# Altium schematic sheet Charging.SchDoc
size A; SheetNumber: 6; SheetTotal: 8
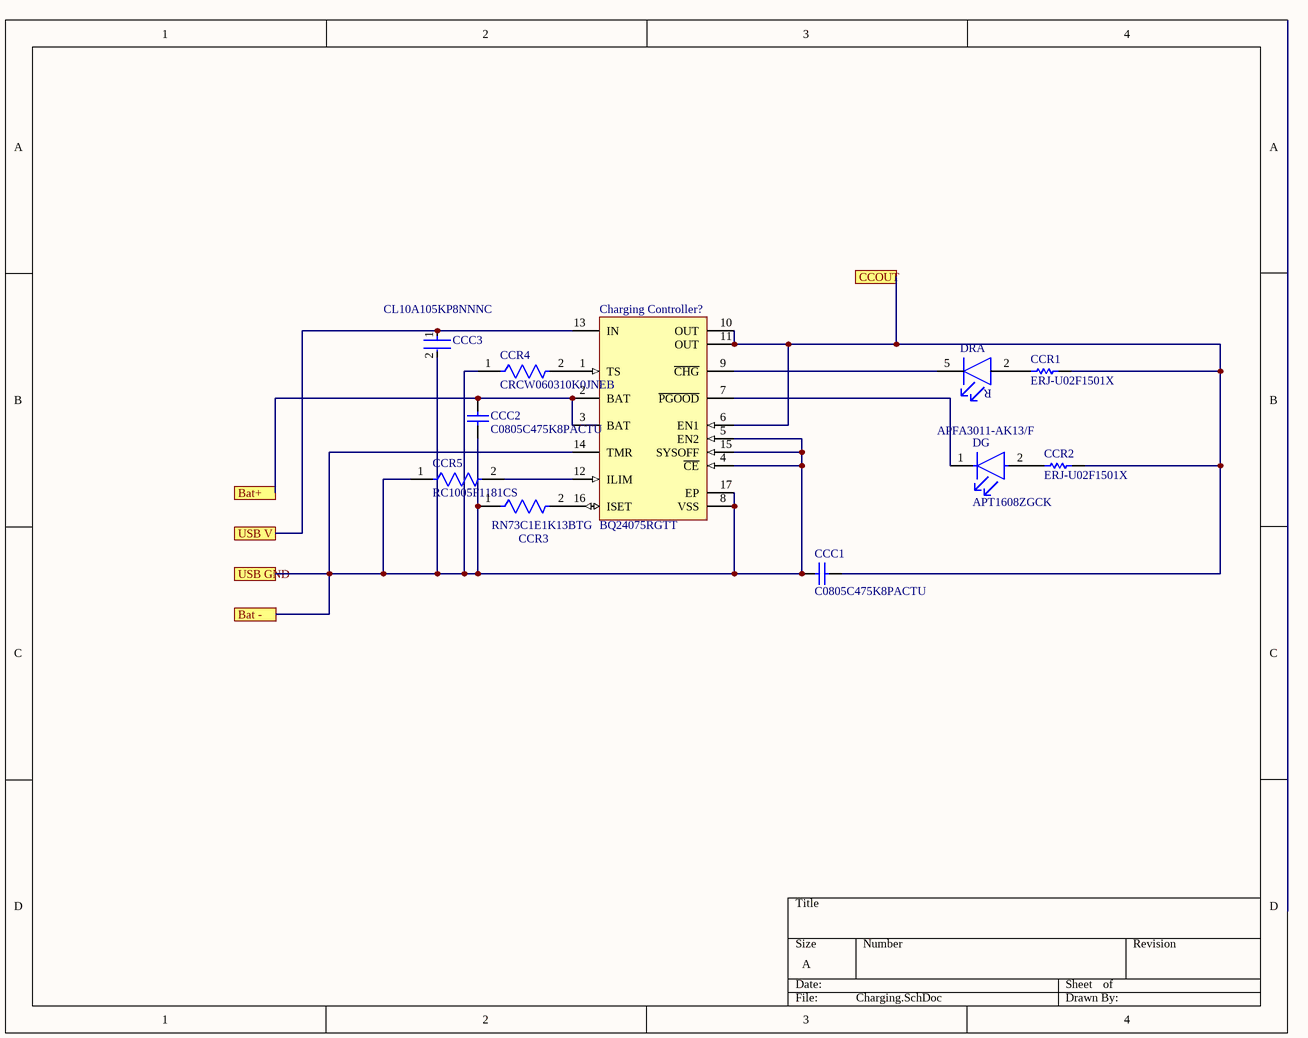
[diagram p0: Charging.SchDoc]

## Parts
CCC1  C0805C475K8PACTU  [CAPC2013X145X50ML20T25]
CCC2  C0805C475K8PACTU  [CAPC2013X145X50ML20T25]
CCC3  CL10A105KP8NNNC  [FP-CL10-IPC_C]
CCR1  ERJ-U02F1501X  [RESC1005X40X25NL05T10]
CCR2  ERJ-U02F1501X  [RESC1005X40X25NL05T10]
CCR3  RN73C1E1K13BTG  [FP-RN731E-MFG]
CCR4  CRCW060310K0JNEB  [FP-CRCW0603-e3-IPC_B]
CCR5  RC1005F1181CS  [FP-RC1005-IPC_A]
Charging_Controller?  BQ24075RGTT  [RGT0016C_V]
DG  APT1608ZGCK  [FP-APT1608ZGCK-MFG]
DR  APFA3011-AK13/F  [FP-APFA3011-AK13-F-MFG]  (part A of 3)

## Ports
Bat -, Bat+, CCOUT, USB GND, USB V

## Nets
Bat -: CCC1.1 CCC2.1 CCC3.2 CCR3.1 CCR4.1 CCR5.1 Charging_Controller?.4(~{CE}) Charging_Controller?.5(EN2) Charging_Controller?.8(VSS) Charging_Controller?.14(TMR) Charging_Controller?.15(SYSOFF) Charging_Controller?.17(EP) ; port USB GND, port Bat -
Bat+: CCC2.2 Charging_Controller?.2(BAT) Charging_Controller?.3(BAT) ; port Bat+
CCOUT: CCC1.2 CCR1.2 CCR2.2 Charging_Controller?.6(EN1) Charging_Controller?.10(OUT) Charging_Controller?.11(OUT) ; port CCOUT
USB V: CCC3.1 Charging_Controller?.13(IN) ; port USB V
NetCCR1_1: CCR1.1 DR.2(Red_A)
NetCCR2_1: CCR2.1 DG.2(A)
NetCCR3_2: CCR3.2 Charging_Controller?.16(ISET)
NetCCR4_2: CCR4.2 Charging_Controller?.1(TS)
NetCCR5_2: CCR5.2 Charging_Controller?.12(ILIM)
NetCharging_Controller?_7: Charging_Controller?.7(~{PGOOD}) DG.1(C)
NetCharging_Controller?_9: Charging_Controller?.9(~{CHG}) DR.5(Red_C)

## Notes on the sheet
- (in symbol CMP-44529-000011-1, part A) R

## Library data of the parts
CCC1 CCC2 = CMP-2007-01007-1: Manufacturer: Kemet; Part Number: C0805C475K8PACTU
CCC3 = CMP-13271-003399-1: Cap Ceramic 1uF 10V X5R ±10% Pad SMD 0603 +85°C T/R; Min Operating Temperature: -55°C; Max Operating Temperature: 85°C; Dielectric: X5R; Contact Plating: Tin; Height: 0.8mm; Voltage: 10V; Packaging: Tape and Reel; Voltage Rating: 10V; Capacitance: 1uF; Package Quantity: 1; Width: 0.031inch; Length: 1.6mm; Depth: 0.8mm; Case/Package: 0603; Case Code (Imperial): 0603; Thickness: 0.035inch; Radiation Hardening: No; Tolerance: 10%; Case Code (Metric): 1608; Mount: Surface Mount
CCR1 CCR2 = CMP-2002-06462-1: Manufacturer: Panasonic; Part Number: ERJ-U02F1501X
CCR3 = CMP-03211-004648-1: Res Thin Film 0402 1.13KΩ 0.1% 1/16W 10ppm/°C Molded SMD; Manufacturer: TE Connectivity; Voltage Rating: 25V; Power Rating: 0.063W; Octopart: https://octopart.com/rn73c1e1k13btg-te+connectivity-42626925; Temperature Coefficient: 10ppm/°C; Resistance: 1.13KΩ; packaging: 250 cut tape length; Series: RN73; Tolerance: 0.1%; Composition: Thin Film; ComponentLink2URL: https://www.te.com/commerce/DocumentDelivery/DDEController?Action=showdoc&DocId=Data+Sheet%7F1773270%7FP%7Fpdf%7FEnglish%7FENG_DS_1773270_P.pdf%7F1-1879132-6; Temperature Range High: +155°C; Temperature: -55°C to +155°C; octopart_url: https://octopart.com/rn73c1e1k13btg-te+connectivity-42626925; Automotive: No; RoHS: TRUE; Height: 0.35mm; Device Class L3: Chip SMD Resistors; Device Class L1: Passive Components; Device Class L2: Resistors; Package: RN731E; Value: 1.13KΩ; Category: Res; Manufacturer Part Number: RN73C1E1K13BTG; Temperature Range Low: -55°C; Lead Free: Yes; Ipc Land Pattern Name: RESC10050X30; ComponentLink2Description: Datasheet
CCR4 = CMP-2000-03839-2: RES Thick Film, 10kΩ, 5%, 0.1W, 200ppm/°C, 0603; Resistance: 10kR; Max Power Dissipation: 100mW; Voltage Rating: 75V; Tolerance: 5%; Weight: 7.1E-05oz; Packaging: Tape and Reel; Length: 1.55mm; Case/Package: 0603; Radiation Hardening: No; Military Standard: Not; Package Quantity: 10000; Depth: 0.85mm; Temperature Coefficient: 200ppm/°C; Width: 0.85mm; Min Operating Temperature: -55°C; Max Operating Temperature: 155°C; Composition: Thick Film; Termination: SMD/SMT; Features: Automotive AEC-Q200; Number of Terminations: 2; Contact Plating: Tin; Case Code (Imperial): 0603; Height: 0.02inch; Power Rating: 100mW; Lead Free: Lead Free; Voltage Rating (DC): 75V; Case Code (Metric): 1608
CCR5 = CMP-13261-002895-1: Res Thick Film 0402 1.18kΩ 1% 0.063W ±100ppm/°C Molded SMD T/R; Voltage Rating (DC): 50V; Max Power Dissipation: 63mW; Resistance: 1.18kR; Tolerance: 1%; Features: Moisture Resistant; Packaging: Tape and Reel; Number of Terminations: 2; Case Code (Metric): 1005; Height: 0.016inch; Power Rating: 63mW; Case Code (Imperial): 0402; Max Operating Temperature: 155°C; Package Quantity: 1; Min Operating Temperature: -55°C; Temperature Coefficient: 100ppm/°C; Depth: 0.5mm; Length: 1mm; Width: 0.02inch; Composition: Thick Film; Case/Package: 0402; Lead Free: Lead Free; Military Standard: Not
Charging_Controller? = CMP-0321-00236-2: USB-Friendly Li-Ion Battery Charger and Power-Path Management IC, Vout 5.5 V, 4.3 V, -40 to 85 degC, 16-pin QFN (RGT), Green (RoHS & no Sb/Br); Manufacturer: Texas Instruments; Vin(Min)(V): 4.3; SubFamily: Battery Charge Management; NiMH: N; PackageDescription: 16-Pin Plastic Quad Flat No-Lead, 3 x 3 mm Body, 0.5 mm Pitch, 1.7 x 1.7 mm Exposed Pad; PartNumber: BQ24075RGTT; PackageVersion: revH, Oct-2011; Eco-Plan: Green (RoHS & no Sb/Br); Code_JEDEC: MO-220; ComponentLink1Description: Datasheet; PackageReference: RGT0016C; NiCd: N; Li-Polymer: N; DatasheetVersion: SLUS810G; ComponentLink1URL: http://www.ti.com/general/docs/lit/getliterature.tsp?genericPartNumber=BQ24075&fileType=pdf; Over Voltage Protection: N; Mounting Technology: Surface Mount; Lead Acid: N; Li-Ion: N
DG = CMP-44529-000024-1: LED GREEN CLEAR CHIP SMD; Forward Voltage: 3.3V; Dominant Wavelength: 525nm; Forward Current: 20mA; Lens Color: Colorless; Viewing Angle: 120°; Luminous Intensity: 350mcd; Lens Transparency: Clear; Color: Green; Max Operating Temperature: 85°C; Case/Package: 0603; Mount: Surface Mount; Min Operating Temperature: -40°C; Case Code (Metric): 1608; Test Current: 20mA; Packaging: Tape and Reel; Width: 0.8mm; Package Quantity: 1; Height: 0.75mm; Length: 1.6mm; Illumination Color: Green; Lead Free: Lead Free; Case Code (Imperial): 0603
DR = CMP-44529-000011-1: LED RGB CLEAR 4SMD R/A; Manufacturer: Kingbright; Forward Current: 20mA; Power Dissipation: 120/120/84mW; Max Junction Temp: +115°C; Led Orientation: Side View; Peak Emmision Wavelength: 465/520/640nm; Forward Voltage: 3.3/3.2/2.2V; Reverse Voltage: 5V; Luminous Intensity: 150/780/410mcd; Viewing Angle: 150°; Wavelength: 470/525/625nm; Package: 0; RoHS: TRUE; Manufacturer Part Number: APFA3011-AK13/F; Digikey Description: LED RGB CLEAR 4SMD R/A; Temperature: -40°C to +85°C; Device Class L1: Optoelectronics; Octopart: https://octopart.com/apfa3011-ak13%2Ff-kingbright-85376835; Device Class L2: LEDs; Temperature Range High: +85°C; Colour: Blue, Green, Red; Height: 1.2mm; Automotive: No; Temperature Range Low: -40°C; Device Class L3: unset; ComponentLink2URL: https://www.kingbrightusa.com/images/catalog/SPEC/APFA3011-AK13-F.pdf; ComponentLink2Description: Datasheet; Lead Free: Yes; Category: Diode; Mouser Description: Led Rgb Clear 4SMD R/a